# EAGLE schematic JDM2-nosocket (EAGLE 7.6.0)
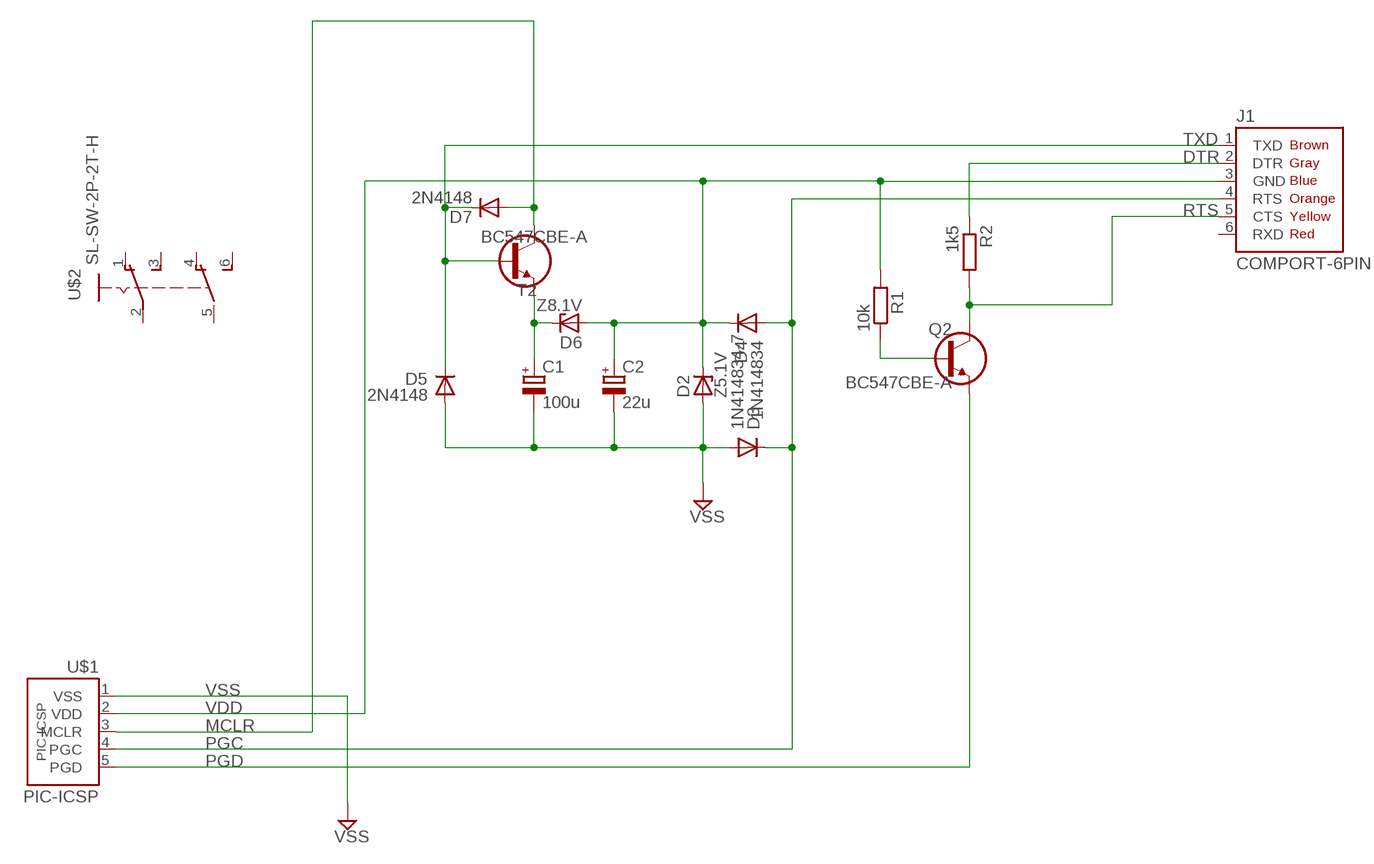
[diagram p0: schematic, sheet 1]

## Parts
C1  100u  CPOLE2.5-5  [E2,5-5]
C2  22u  CPOLE2,5-4  [E2,5-4]
D2  Z5.1V  Z-DIODEZ2_54  [DO35Z2_54]
D3  1N414834-7  [DO34-7]
D4  1N414834  1N414834-7  [DO34-7]
D5  2N4148  1N414834-7  [DO34-7]
D6  Z8.1V  Z-DIODEZ2_54  [DO35Z2_54]
D7  2N4148  2N41482_54  [DO35-2_54]
J1  COMPORT-6PIN  [RS232-6PIN]
Q2  BC547CBE-A  [TO92-CBE-A]
R1  10k  R-EU_0204/7  [0204/7]
R2  1k5  R-EU_0207/7  [0207/7]
T2  BC547CBE-A  [TO92-CBE-A]
U$1  PIC-ICSP  [CONN-5P]
U$2  SL-SW-2P-2T-H  [SLSW-2P2T-H]

## Nets
DTR: J1.2(DTR) R2.1
MCLR: D7.A T2.C U$1.3(MCLR)
N$3: Q2.B R1.1
N$8: C1.+ D6.C T2.E
PGC: D3.C D4.A J1.4(RTS) U$1.4(PGC)
PGD: Q2.E U$1.5(PGD)
RTS: J1.5(CTS) Q2.C R2.2
TXD: D5.C D7.C J1.1(TXD) T2.B
VDD: C2.+ D2.C D4.C D6.A R1.2 U$1.2(VDD)
VSS: C1.- C2.- D2.A D3.A D5.A U$1.1(VSS)
Unconnected: J1.3(GND) J1.6(RXD) U$2.1(O) U$2.2(P) U$2.3(S) U$2.4(O1) U$2.5(P1) U$2.6(S1)

## Library data of the parts
C1 C2 = c:CPOL: POLARIZED CAPACITOR, European symbol
D2 D6 = JDM2:Z-DIODE
D3-D5 = d:1N4148
D7 = JDM2:2N4148
J1 = pinconn:COMPORT-6PIN
Q2 T2 = t:BC547
R1 R2 = rcl:R-EU_: RESISTOR, European symbol
U$1 = pinconn:PIC-ICSP
U$2 = sw:SL-SW-2P-2T